# Altium schematic sheet ESP12.SchDoc
size A
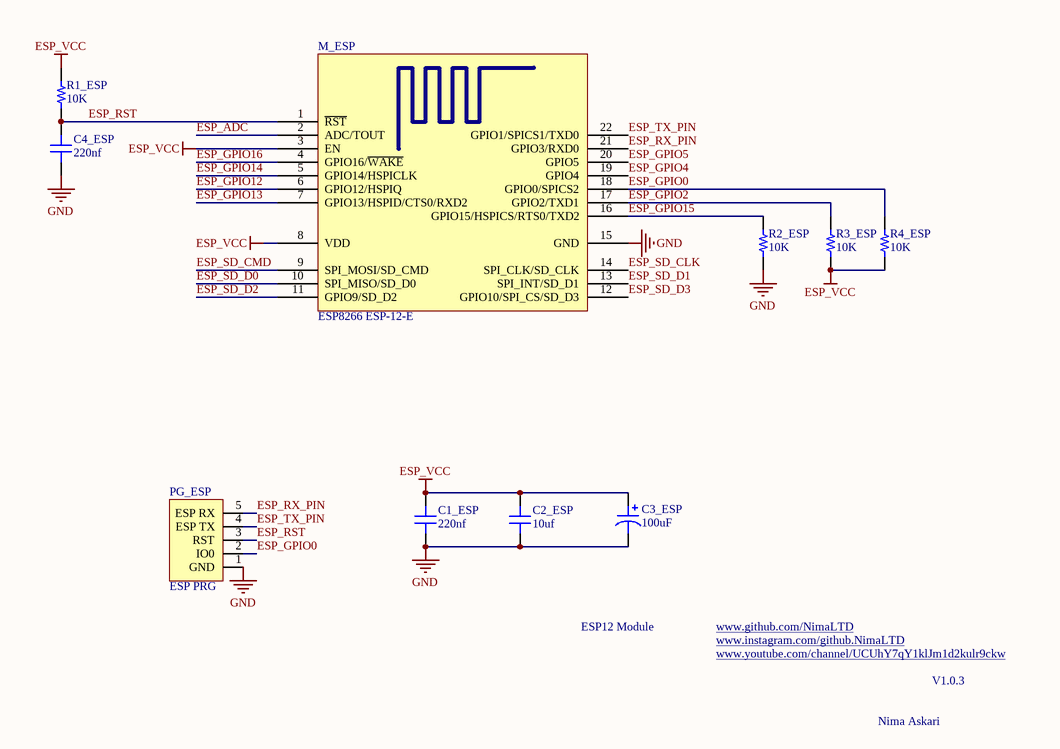
[diagram p0: ESP12.SchDoc]

## Parts
C1_ESP  220nf  [CAP 0805]
C2_ESP  10uf  [CAP 0805]
C3_ESP  100uF  [CAP AL SMD D6 H6]
C4_ESP  220nf  [CAP 0805]
M_ESP  ESP8266 ESP-12-E  [M_ESP12]
PG_ESP  ESP PRG  [HDR2_M_1X5]
R1_ESP  10K  [RES 0805]
R2_ESP  10K  [RES 0805]
R3_ESP  10K  [RES 0805]
R4_ESP  10K  [RES 0805]

## Nets
ESP_VCC: C1_ESP.2 C2_ESP.2 C3_ESP.1 M_ESP.3(EN) M_ESP.8(VDD) R1_ESP.2 R3_ESP.2 R4_ESP.2
GND: C1_ESP.1 C2_ESP.1 C3_ESP.2 C4_ESP.1 M_ESP.15(GND) PG_ESP.1(GND) R2_ESP.2
ESP_ADC: M_ESP.2(ADC/TOUT)
ESP_GPIO0: M_ESP.18(GPIO0/SPICS2) PG_ESP.2(IO0) R4_ESP.1
ESP_GPIO2: M_ESP.17(GPIO2/TXD1) R3_ESP.1
ESP_GPIO4: M_ESP.19(GPIO4)
ESP_GPIO5: M_ESP.20(GPIO5)
ESP_GPIO12: M_ESP.6(GPIO12/HSPIQ)
ESP_GPIO13: M_ESP.7(GPIO13/HSPID/CTS0/RXD2)
ESP_GPIO14: M_ESP.5(GPIO14/HSPICLK)
ESP_GPIO15: M_ESP.16(GPIO15/HSPICS/RTS0/TXD2) R2_ESP.1
ESP_GPIO16: M_ESP.4(GPIO16/~{WAKE})
ESP_RST: C4_ESP.2 M_ESP.1(~{RST}) PG_ESP.3(RST) R1_ESP.1
ESP_RX_PIN: M_ESP.21(GPIO3/RXD0) PG_ESP.5(ESP_RX)
ESP_SD_CLK: M_ESP.14(SPI_CLK/SD_CLK)
ESP_SD_CMD: M_ESP.9(SPI_MOSI/SD_CMD)
ESP_SD_D0: M_ESP.10(SPI_MISO/SD_D0)
ESP_SD_D1: M_ESP.13(SPI_INT/SD_D1)
ESP_SD_D2: M_ESP.11(GPIO9/SD_D2)
ESP_SD_D3: M_ESP.12(GPIO10/SPI_CS/SD_D3)
ESP_TX_PIN: M_ESP.22(GPIO1/SPICS1/TXD0) PG_ESP.4(ESP_TX)

## Notes on the sheet
- ESP12 Module
- www.github.com/NimaLTD <http://www.github.com/NimaLTD>
- www.instagram.com/github.NimaLTD <http://www.instagram.com/github.NimaLTD>
- www.youtube.com/channel/UCUhY7qY1klJm1d2kulr9ckw <http://www.youtube.com/channel/UCUhY7qY1klJm1d2kulr9ckw>
- V1.0.3
- Nima Askari

## Library data of the parts
C1_ESP C2_ESP C4_ESP = Cap SMD 0805: SMT Capacitor
  C1_ESP C4_ESP: Value: 220nf
  C2_ESP: Value: 10uf
C3_ESP = Pol Cap SMD AL D6 H6: SMT Polarised Capacitor; Value: 100uF
PG_ESP = ESP PRG P2.0
R1_ESP R2_ESP R3_ESP R4_ESP = Res SMD 0805: SMD Resistor; Value: 10K